# Altium schematic sheet DISPLAY.SchDoc
size A4; SheetNumber: 2; SheetTotal: 4
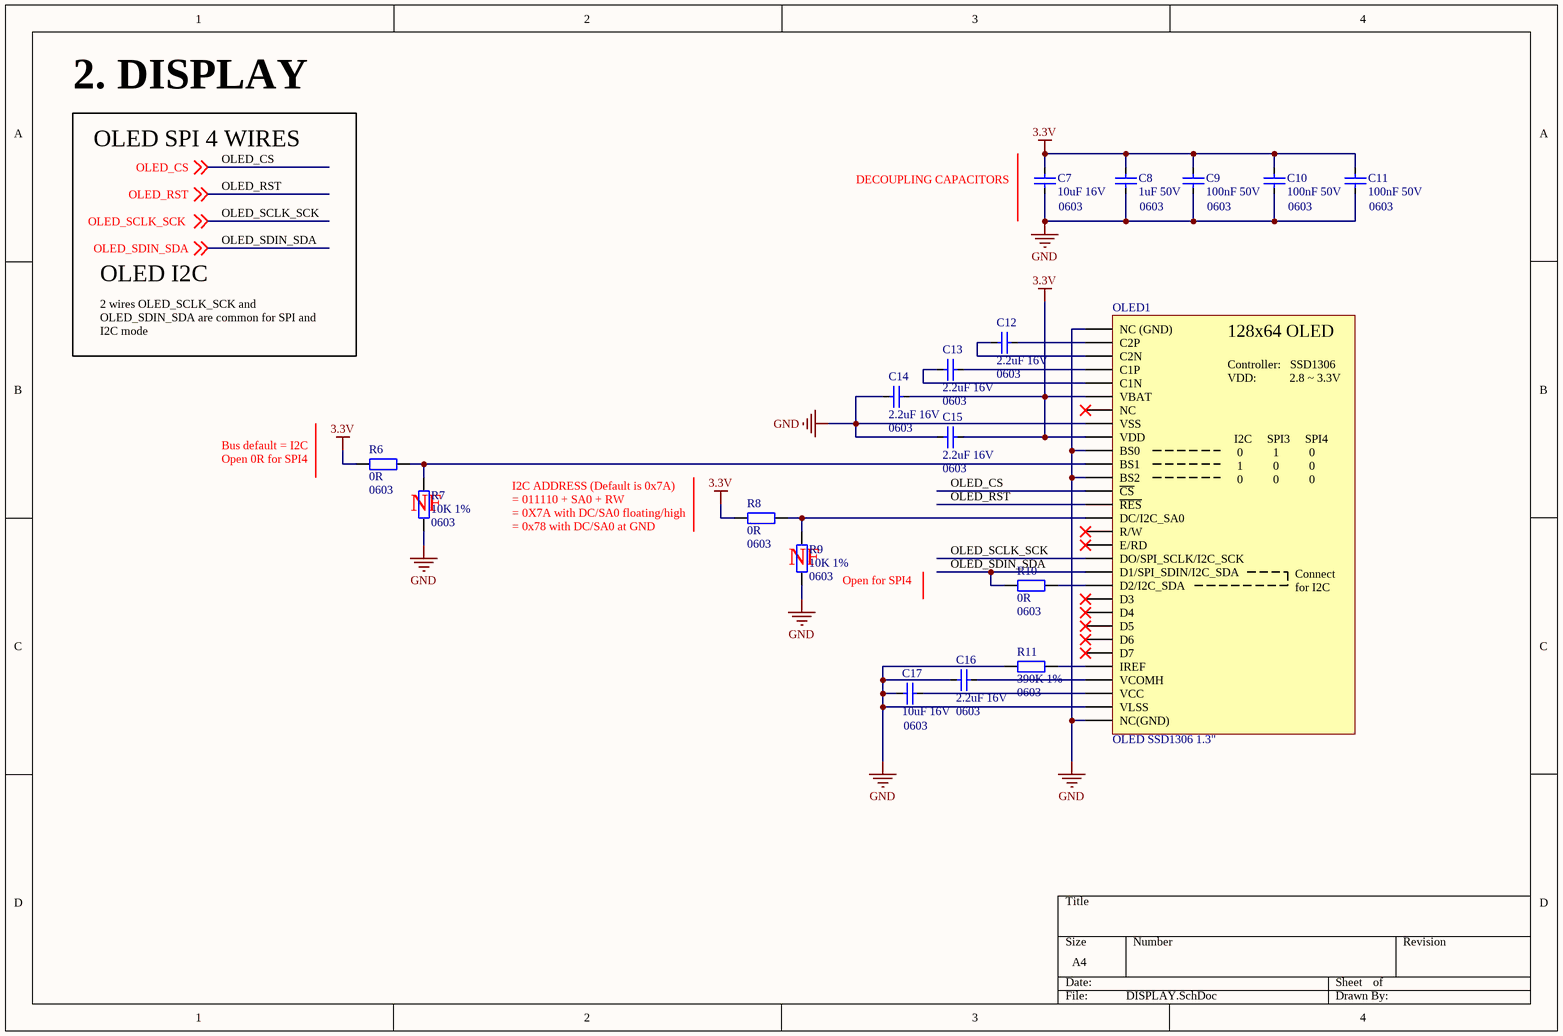
[diagram p0: DISPLAY.SchDoc]

## Parts
C7  10uF 16V  Size: 0603  [CAP_SMD_0603]
C8  1uF 50V  Size: 0603  [CAP_SMD_0603]
C9  100nF 50V  Size: 0603  [CAP_SMD_0603]
C10  100nF 50V  Size: 0603  [CAP_SMD_0603]
C11  100nF 50V  Size: 0603  [CAP_SMD_0603]
C12  2.2uF 16V  Size: 0603  [CAP_SMD_0603]
C13  2.2uF 16V  Size: 0603  [CAP_SMD_0603]
C14  2.2uF 16V  Size: 0603  [CAP_SMD_0603]
C15  2.2uF 16V  Size: 0603  [CAP_SMD_0603]
C16  2.2uF 16V  Size: 0603  [CAP_SMD_0603]
C17  10uF 16V  Size: 0603  [CAP_SMD_0603]
OLED1  OLED SSD1306 1.3"  [OLED 1.3]
R6  0R  Size: 0603  [RES_SMD_0603]
R7  10K 1%  Size: 0603  [RES_SMD_0603]
R8  0R  Size: 0603  [RES_SMD_0603]
R9  10K 1%  Size: 0603  [RES_SMD_0603]
R10  0R  Size: 0603  [RES_SMD_0603]
R11  390K 1%  Size: 0603  [RES_SMD_0603]

## Nets
3.3V: C7.2 C8.2 C9.2 C10.2 C11.2 C14.2 C15.2 OLED1.A6(VBAT) OLED1.A9(VDD) R6.1 R8.1
GND: C7.1 C8.1 C9.1 C10.1 C11.1 C14.1 C15.1 C16.2 C17.1 OLED1.A1(NC_(GND)) OLED1.A8(VSS) OLED1.A10(BS0) OLED1.A12(BS2) OLED1.A29(VLSS) OLED1.A30(NC(GND)) R7.1 R9.1 R11.1
OLED_CS: OLED1.A13(~{CS}) ; off-sheet OLED_CS
OLED_RST: OLED1.A14(~{RES}) ; off-sheet OLED_RST
OLED_SCLK_SCK: OLED1.A18(DO/SPI_SCLK/I2C_SCK) ; off-sheet OLED_SCLK_SCK   [also labelled OLED_SCLK_SCK ]
OLED_SDIN_SDA : OLED1.A19(D1/SPI_SDIN/I2C_SDA) R10.1 ; off-sheet OLED_SDIN_SDA  [also labelled OLED_SDIN_SDA]
NetC12_1: C12.1 OLED1.A2(C2P)
NetC12_2: C12.2 OLED1.A3(C2N)
NetC13_1: C13.1 OLED1.A5(C1N)
NetC13_2: C13.2 OLED1.A4(C1P)
NetC16_1: C16.1 OLED1.A27(VCOMH)
NetC17_2: C17.2 OLED1.A28(VCC)
NetOLED1_A11: OLED1.A11(BS1) R6.2 R7.2
NetOLED1_A15: OLED1.A15(DC/I2C_SA0) R8.2 R9.2
NetOLED1_A20: OLED1.A20(D2/I2C_SDA) R10.2
NetOLED1_A26: OLED1.A26(IREF) R11.2

Not connected (* = marked no-connect by the designer): OLED1 A7(NC)* A16(R/W)* A17(E/RD)* A21(D3)* A22(D4)* A23(D5)* A24(D6)* A25(D7)*

## Notes on the sheet
- 2. DISPLAY
- OLED SPI 4 WIRES
- DECOUPLING CAPACITORS
- OLED I2C
- 2 wires OLED_SCLK_SCK and OLED_SDIN_SDA are common for SPI and I2C mode
- Bus default = I2C
  Open 0R for SPI4
- (near R7) NF
- (near R9) NF
- I2C ADDRESS (Default is 0x7A)
  = 011110 + SA0 + RW
  = 0X7A with DC/SA0 floating/high
  = 0x78 with DC/SA0 at GND
- (near R9) Open for SPI4
- (in symbol 1.3"_SSD1306_OLED) 128x64 OLED; Controller:   SSD1306 / VDD:           2.8 ~ 3.3V; I2C     SPI3     SPI4 / 0          1          0 / 1          0          0 / 0          0          0 /; Connect for I2C

## Library data of the parts
C7 C17 = C0603_MLCC_10uF_16V: 10 µF ±20% 16V Ceramic Capacitor X6S 0603 (1608 Metric); Manufacturer: Murata Electronics; Manufacture Part Number: GRM188C81C106MA73D; Packaging: Cut Tape (CT); Link: https://www.digikey.cn/en/products/detail/murata-electronics/GRM188C81C106MA73D/3900463; Price: $0.25
C8 = C0603_MLCC_1uF_50V: 1 µF ±10% 50V Ceramic Capacitor X5R 0603 (1608 Metric); Manufacturer: Samsung Electro-Mechanics; Manufacture Part Number: CL10A105KB8NNNC; Packaging: Cut Tape (CT); Link: https://www.digikey.cn/en/products/detail/samsung-electro-mechanics/CL10A105KB8NNNC/3887518; Price: $0.14
C9-C11 = C0603_MLCC_100nF_50V: 0.1 µF ±10% 50V Ceramic Capacitor X7R 0603 (1608 Metric); Manufacturer: Samsung Electro-Mechanics; Manufacture Part Number: CL10B104KB8NNNC; Packaging: Cut Tape (CT); Link: https://www.digikey.cn/en/products/detail/samsung-electro-mechanics/CL10B104KB8NNNC/3886658; Price: $0.10
C12-C16 = C0603_MLCC_2.2uF_16V: 2.2 µF ±10% 16V Ceramic Capacitor X5R 0603 (1608 Metric); Manufacturer: Samsung Electro-Mechanics; Manufacture Part Number: CL10A225KO8NNNC; Packaging: Cut Tape (CT); Link: https://www.digikey.cn/en/products/detail/samsung-electro-mechanics/CL10A225KO8NNNC/3886698; Price: $0.10
OLED1 = 1.3"_SSD1306_OLED: SSD1306 1.3 - Organic Light Emitting Diode Display Screen ROHS; Manufacturer: UG(Univision Semicon); Manufacture Part Number: UG-2864KSWLG01; Link: https://www.lcsc.com/product-detail/Organic-Light-Emitting-Diode-Display-Screen_UG-Univision-Semicon-UG-2864KSWLG01_C113322.html; Price: $1.96; ComponentLink1Description: New link; ComponentLink1URL: *; Link 2: https://shopee.vn/M%C3%A0n-h%C3%ACnh-LCD-SUBEI-ssd1306-12864-B%E1%BA%A3ng-m%C3%A0n-h%C3%ACnh-LCD-LCD-m%C3%B4-%C4%91un-m%C3%A0n-h%C3%ACnh-LCD-OLED-1-3-inch-12864-OLED-30PIN-c%C3%B3-th%E1%BB%83-s%E1%BB%AD-d%E1%BB%A5ng-i.293689495.25025709755?sp_atk=b5fb3fe1-8310-4ca9-bbd1-9b1802fa8d8a&xptdk=b5fb3fe1-8310-4ca9-bbd1-9b1802fa8d8a
R6 R8 R10 = R0603_0R: 0 Ohms Jumper Chip Resistor 0603 (1608 Metric) Automotive AEC-Q200 Thick Film; Manufacturer: Stackpole Electronics Inc; Manufacture Part Number: RMCF0603ZT0R00; Packaging: Cut Tape (CT); Link: https://www.digikey.cn/en/products/detail/stackpole-electronics-inc/RMCF0603ZT0R00/1756908; Price: $0.10
R7 R9 = R0603_10K: 10 kOhms ±1% 0.1W, 1/10W Chip Resistor 0603 (1608 Metric) Moisture Resistant Thick Film; Manufacturer: YAGEO; Manufacture Part Number: RC0603FR-0710KL; Packaging: Cut Tape (CT); Link: https://www.digikey.cn/en/products/detail/yageo/RC0603FR-0710KL/726880; Price: $0.10
R11 = R0603_390K: 390 kOhms ±1% 0.1W, 1/10W Chip Resistor 0603 (1608 Metric) Moisture Resistant Thick Film; Manufacturer: YAGEO; Manufacture Part Number: RC0603FR-07390KL; Packaging: Cut Tape (CT); Link: https://www.digikey.cn/en/products/detail/yageo/RC0603FR-07390KL/727199; Price: $0.10